# Altium schematic sheet RF_circuit.SchDoc
size 420 x 297 mm; SheetNumber: 4; SheetTotal: 4
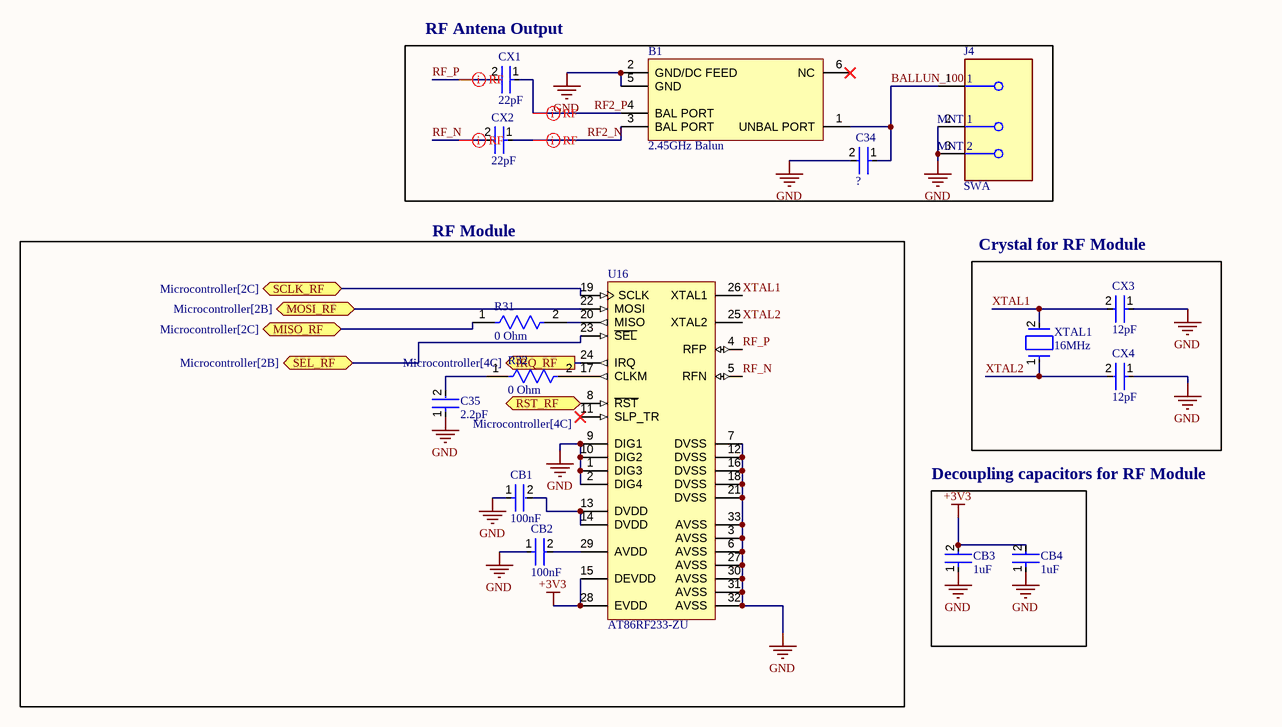
[diagram p0: RF_circuit.SchDoc]

## Parts
B1  2.45GHz Balun  [WE-BAL_0805]
C34  ?  [FP-CC0805-0_85-MFG]
C35  2.2pF  [FP-CC0805-0_85-MFG]
CB1  100nF  [FP-CC0805-0_85-MFG]
CB2  100nF  [FP-CC0805-0_85-MFG]
CB3  1uF  [FP-CC0805-0_85-MFG]
CB4  1uF  [FP-CC0805-0_85-MFG]
CX1  22pF  [FP-CC0805-0_85-MFG]
CX2  22pF  [FP-CC0805-0_85-MFG]
CX3  12pF  [FP-CC0805-0_85-MFG]
CX4  12pF  [FP-CC0805-0_85-MFG]
J4  SWA  [FP-142-0701-801-MFG]
R31  0 Ohm  [FP-RMCF0805-MFG]
R32  0 Ohm  [FP-RMCF0805-MFG]
U16  AT86RF233-ZU  [32QN2_M]
XTAL1  16MHz  [FP-ABLS-MFG]

## Blocks framed on the sheet
RF Module: C35 CB1 CB2 R31 R32 U16
Crystal for RF Module: CX3 CX4 XTAL1
Decoupling capacitors for RF Module: CB3 CB4

## Ports
IRQ_RF (out, see Microcontroller[4C]), MISO_RF (bidir, see Microcontroller[2C]), MOSI_RF (bidir, see Microcontroller[2B]), RST_RF (bidir, see Microcontroller[4C]), SCLK_RF (bidir, see Microcontroller[2C]), SEL_RF (bidir, see Microcontroller[2B])

## Nets
+3V3: CB3.2 CB4.2 U16.15(DEVDD) U16.28(EVDD)
GND: B1.2(GND/DC_FEED) B1.5(GND) C34.2 C35.1 CB1.1 CB2.1 CB3.1 CB4.1 CX3.1 CX4.1 J4.2(MNT_1) J4.3(MNT_2) U16.1(DIG3) U16.2(DIG4) U16.3(AVSS) U16.6(AVSS) U16.7(DVSS) U16.9(DIG1) U16.10(DIG2) U16.12(DVSS) U16.16(DVSS) U16.18(DVSS) U16.21(DVSS) U16.27(AVSS) U16.30(AVSS) U16.31(AVSS) U16.32(AVSS) U16.33(AVSS)
BALLUN_100: B1.1(UNBAL_PORT) C34.1 J4.1
IRQ_RF: U16.24(IRQ) ; port IRQ_RF
MISO_RF: R31.1 ; port MISO_RF
MOSI_RF: U16.22(MOSI) ; port MOSI_RF
RF2_N: B1.3(BAL_PORT) CX2.1
RF2_P: B1.4(BAL_PORT) CX1.1
RF_N: CX2.2 U16.5(RFN)
RF_P: CX1.2 U16.4(RFP)
RST_RF: U16.8(~{RST}) ; port RST_RF
SCLK_RF: U16.19(SCLK) ; port SCLK_RF
SEL_RF: U16.23(~{SEL}) ; port SEL_RF
XTAL1: CX3.2 U16.26(XTAL1) XTAL1.2
XTAL2: CX4.2 U16.25(XTAL2) XTAL1.1
NetC35_2: C35.2 R32.1
NetCB1_2: CB1.2 U16.13(DVDD) U16.14(DVDD)
NetCB2_2: CB2.2 U16.29(AVDD)
NetR31_2: R31.2 U16.20(MISO)
NetR32_2: R32.2 U16.17(CLKM)

Not connected (* = marked no-connect by the designer): B1 6(NC)*; U16 11(SLP_TR)*

## Layout directives
differential pair; differential pair class RF: RF2_N, RF2_P, RF_N, RF_P

## Notes on the sheet
- (near CX1) RF Antena Output
- THIS DOCUMENT AND THE DATA DISCLOSED HEREIN OR
- HEREWITH IS THE PROPERTY OF ALTIUM LIMITED AND MAY
- DWG NO:
- REVISION
- REV:
- DESCRIPTION
- DATE
- APPROVED
- BE FREELY DISTRIBUTED IN WHOLE. NO RIGHTS ARE
- RESERVED OR EXPRESS OR IMPLIED WARANTEE GIVEN.
- ENG:
- APPROVALS
- PROJECT
- DSN:
- CHK:
- REFERENCE DOCUMENTS
- PROJECT REVISION:
- TITLE
- DOCUMENT REVISION:
- DESIGN ITEM:
- BOM:
- FAB DWG:
- PCB DWG:
- ASSY DWG:
- SCALE:
- A3
- SIZE
- CAGE CODE
- FILE NAME
- DWG NO.
- SHEET
- OF
- REV

## Library data of the parts
B1 = CMP-03913-19122360-1: 748421245 100O Surface Mount Chip Balun; Insertion Loss (dB): 0.54dB; Impedance: 100Ω; Frequency: 2.5GHz; Depth: 850µm; Case Code (Metric): 2012; Height: 850µm; Max Operating Temperature: 85°C; Length: 2mm; Width: 1.25mm; Termination: SMD/SMT; Case Code (Imperial): 0805; Number of Pins: 6; RoHS: Compliant; Max Switching Frequency: 2.5GHz; NexarPartId: 19122360; REACH SVHC: Unknown; Case/Package: 0805; Min Operating Temperature: -40°C; Lead Free: Lead Free; Mount: Surface Mount; Max Frequency: 2.5GHz; Packaging: Cut Tape (CT)
C34 C35 = CMP-2100-03606-3: CAP CER 0.1UF 50V X7R 0805; Manufacturer Part Number: CC0805KRX7R9BB104; Manufacturer: Yageo; Tolerance: 0.1; Capacitance: 100 nF; Value: 100 nF; Material: Ceramic; Device Class L1: Passive Components; ComponentLink2Description: Datasheet; Package: CC0805-0.85; Digikey Description: CAP CER 0.1UF 50V X7R 0805; Device Class L3: Ceramic Capacitors; Temperature: -30°C to +85°C; Temperature Characteristic: X7R; Voltage Rating: 50 V; Height: 0.95mm; RoHS: TRUE; Ipc Land Pattern Name: CAPC200125X85; Device Class L2: Capacitors; Category: Cap; Temperature Range Low: -30°C; Temperature Range High: +85°C; Mouser Description: Multilayer Ceramic Capacitors MLCC - SMD/SMT 100nF 50V X7R 10%; Footprint Url: http://www.yageo.com/exep/pages/download/literatures/UPY-C_GEN_24.pdf; Automotive: No; Octopart: https://octopart.com/cc0805krx7r9bb104-yageo-192993; Lead Free: Yes; ComponentLink2URL: http://www.yageo.com/documents/recent/UPY-GPHC_Y5V_6.3V-to-50V_8.pdf
CB1 CB2 = CMP-2100-03606-3: CAP CER 0.1UF 50V X7R 0805; Manufacturer Part Number: CC0805KRX7R9BB104; Manufacturer: Yageo; Tolerance: 0.1; Device Class L1: Passive Components; ComponentLink2Description: Datasheet; Package: CC0805-0.85; Digikey Description: CAP CER 0.1UF 50V X7R 0805; Capacitance: 100 nF; Device Class L3: Ceramic Capacitors; Value: 100 nF; Temperature: -30°C to +85°C; Temperature Characteristic: X7R; Voltage Rating: 50 V; Height: 0.95mm; RoHS: TRUE; Ipc Land Pattern Name: CAPC200125X85; Device Class L2: Capacitors; Category: Cap; Temperature Range Low: -30°C; Temperature Range High: +85°C; Material: Ceramic; Mouser Description: Multilayer Ceramic Capacitors MLCC - SMD/SMT 100nF 50V X7R 10%; Footprint Url: http://www.yageo.com/exep/pages/download/literatures/UPY-C_GEN_24.pdf; Automotive: No; Octopart: https://octopart.com/cc0805krx7r9bb104-yageo-192993; Lead Free: Yes; ComponentLink2URL: http://www.yageo.com/documents/recent/UPY-GPHC_Y5V_6.3V-to-50V_8.pdf
CB3 CB4 CX1-CX4 = CMP-2100-03606-3: CAP CER 0.1UF 50V X7R 0805; Manufacturer Part Number: CC0805KRX7R9BB104; Manufacturer: Yageo; Tolerance: 0.1; Capacitance: 100 nF; Value: 100 nF; Device Class L1: Passive Components; ComponentLink2Description: Datasheet; Package: CC0805-0.85; Digikey Description: CAP CER 0.1UF 50V X7R 0805; Device Class L3: Ceramic Capacitors; Temperature: -30°C to +85°C; Temperature Characteristic: X7R; Voltage Rating: 50 V; Height: 0.95mm; RoHS: TRUE; Ipc Land Pattern Name: CAPC200125X85; Device Class L2: Capacitors; Category: Cap; Temperature Range Low: -30°C; Temperature Range High: +85°C; Material: Ceramic; Mouser Description: Multilayer Ceramic Capacitors MLCC - SMD/SMT 100nF 50V X7R 10%; Footprint Url: http://www.yageo.com/exep/pages/download/literatures/UPY-C_GEN_24.pdf; Automotive: No; Octopart: https://octopart.com/cc0805krx7r9bb104-yageo-192993; Lead Free: Yes; ComponentLink2URL: http://www.yageo.com/documents/recent/UPY-GPHC_Y5V_6.3V-to-50V_8.pdf
J4 = CMP-09588-000002-1: Frequency: 18GHz; Operating Frequency: 0 to 18 GHz; Body Material: Brass; Impedance: 50R; Connector Type: SMA; Voltage Rating: 335V; Gender: Female; Body Plating: Gold; Orientation: Straight; Length: 0.44inch; Max Operating Temperature: 165°C; Package Quantity: 5; Packaging: Bulk; Series: SMA; Contact Material: Copper; Min Operating Temperature: -65°C; Depth: 25.58mm; RoHS Compliant: Yes; Case/Package: SMA; Max Frequency: 18GHz; Radiation Hardening: No; Contact Plating: Gold; Mount: Edge; Fastening Type: Threaded; Termination: Solder
R31 R32 = CMP-26527-000017-1: RES 0 OHM JUMPER 1/8W 0805; Power Rating: 125mW; Resistance: 0mR; Depth: 1.25mm; Length: 2mm; Military Standard: Not; Width: 0.049inch; Case Code (Imperial): 0805; Number of Terminations: 2; Mount: Surface Mount; Contact Plating: Tin; Height: 0.026inch; Case/Package: 0805; Min Operating Temperature: -55°C; Composition: Thick Film; Max Operating Temperature: 155°C; Packaging: Tape and Reel; Features: Automotive AEC-Q200; Max Power Dissipation: 125mW; Radiation Hardening: No; Lead Free: Lead Free; Case Code (Metric): 2012
U16 = CMP-0295-00009-1: Low Power, 2.4GHz Transceiver for ZigBee, RF4CE, IEEE 802.15.4, 6LoWPAN, and ISM Application, 1.8 to 3.6 V, -40 to 85 degC, 32-Pin VQFN (QN2), RoHS, Tray; Manufacturer: Atmel; Frequency Band: 2445 MHz Typ.; Data Rate: 2 Mb/s Max.; Power Output: 4 dBm Typ.; PackageVersion: Rev. A; ComponentLink3URL: http://www.atmel.com/Images/Atmel-8351-MCU_Wireless-AT86RF233_Datasheet.pdf; Temperature Range: -40 to 85 degC; DatasheetVersion: Rev. 8315E; ComponentLink1Description: Manufacturer URL; ComponentLink2Description: Datasheet; ComponentLink3Description: Package Specification; Mounting Technology: Surface Mount; RoHS: TRUE; ComponentLink1URL: www.atmel.com/; PartNumber: AT86RF233-ZU; ComponentLink2URL: http://www.atmel.com/Images/Atmel-8351-MCU_Wireless-AT86RF233_Datasheet.pdf; Voltage Range: 1.8 to 3.6 V; PackageDescription: 32-Pin Quad Flat Non-Leaded Package, Body 5 x 5 mm, Pitch 0.5 mm; Packing: Tray
XTAL1 = CMP-27762-000003-1: CRYSTAL 16.0000MHZ 18PF SMD; Manufacturer Part Number: ABLS-16.000MHZ-K4T; Manufacturer: Abracon; Stability: 50ppm; Tolerance: 30ppm; Standoff Height: 0mm; Esr: 40Ω; ComponentLink2URL: https://abracon.com/Resonators/abls.pdf; Frequency: 16MHz; Temperature Range High: +125°C; Package: ABLS; Device Class L3: Crystals; Temperature: -40°C to +125°C; Load Capacitance: 18pF; Device Class L2: Crystals / Oscillators; Mouser Description: Crystal 16MHz ±30ppm (Tol) ±50ppm (Stability) 18pF FUND 40Ohm 2-Pin HC-49/US SMD T/R; Category: Crys; ComponentLink2Description: Datasheet; Series: ABLS; Automotive: No; Octopart: https://octopart.com/abls-16.000mhz-k4t-abracon-18618626; RoHS: TRUE; Digikey Description: CRYSTAL 16.0000MHZ 18PF SMD; Temperature Range Low: -40°C; Lead Free: Yes; Height: 4.3mm; Device Class L1: Passive Components